# Altium schematic sheet Si4455.SchDoc
size 420 x 297 mm; Address1: Address1; Address2: Address2; Address3: Address3; Address4: Address4; DocumentNumber: 7; SheetNumber: 7; SheetTotal: 7; Scale: 1:1; Обозначение документа: АБВГ.123456.001 Э3; Разраб.: Иванов; Пров.: Петров; Утв.: Сидоров; Наименование организации: ОАО "Ваша фирма"; Перв. применение: АБВГ.123456.000; Наименование изделия 1: Плата; Наименование изделия 2: Схема электрическая; Наименование изделия 3: принципиальная; Нач. отд.: Нач. отд.; Фамилия нач. отд.: Сидоров
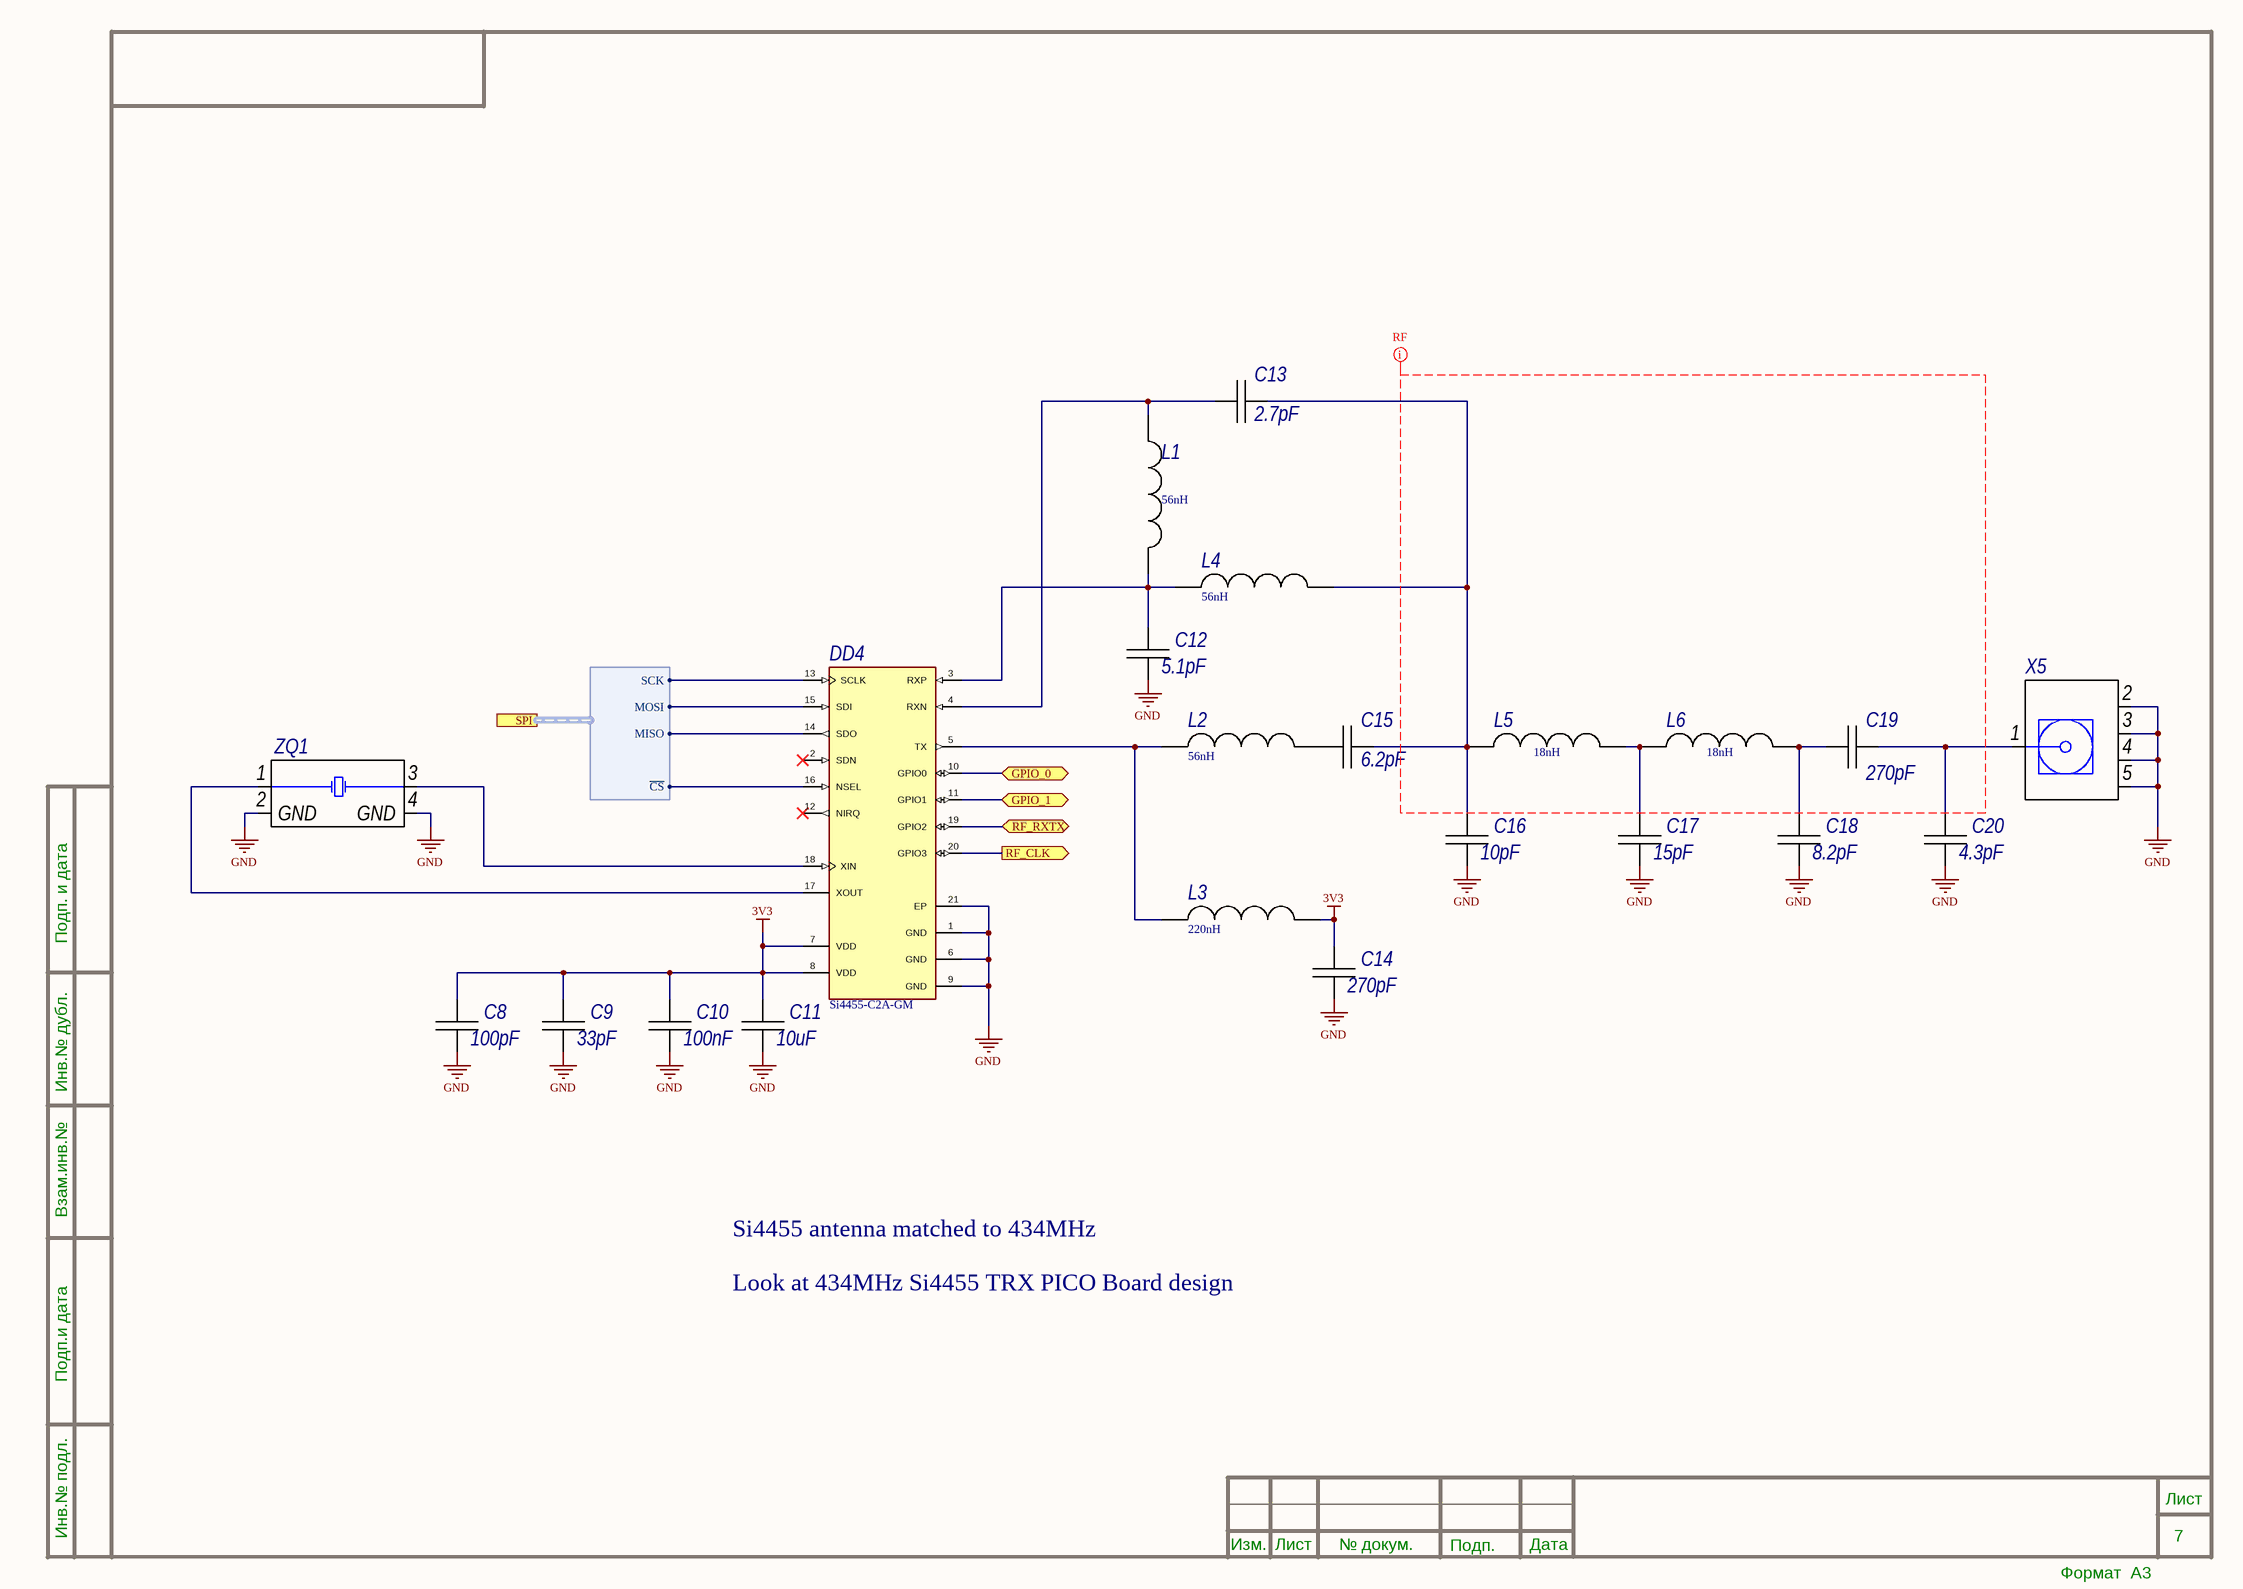
[diagram p0: Si4455.SchDoc]

## Parts
C8  100pF  [CAP0402]
C9  33pF  [CAP0402]
C10  100nF  [CAP0402]
C11  10uF  [CAPC0603N]
C12  5.1pF  [CAP0402]
C13  2.7pF  [CAP0402]
C14  270pF  [CAP0402]
C15  6.2pF  [CAP0402]
C16  10pF  [CAP0402]
C17  15pF  [CAP0402]
C18  8.2pF  [CAP0402]
C19  270pF  [CAP0402]
C20  4.3pF  [CAP0402]
DD4  Si4455-С2A-GM  [SLAB-QFN-20]
L1  56nH  [RESC0402(1005)_M]
L2  56nH  [RESC0402(1005)_M]
L3  220nH  [RESC0402(1005)_M]
L4  56nH  [RESC0402(1005)_M]
L5  18nH  [RESC0402(1005)_M]
L6  18nH  [RESC0402(1005)_M]
X5  (no value)  [60311042114502]
ZQ1  X322525MOB4SI  [TSX-3225_V]  (value not drawn)

## Ports
GPIO_0 (bidir), GPIO_1 (bidir), RF_CLK (out), RF_RXTX (bidir), SPI (harness SPI)

## Harnesses
SPI: SCK, MOSI, MISO, ~{CS}

## Nets
3V3: C8.2 C9.2 C10.2 C11.1 C14.1 DD4.7(VDD) DD4.8(VDD) L3.2
GND: C8.1 C9.1 C10.1 C11.2 C12.2 C14.2 C16.2 C17.2 C18.2 C20.2 DD4.1(GND) DD4.6(GND) DD4.9(GND) DD4.21(EP) X5.2(GND) X5.3(GND) X5.4(GND) X5.5(GND) ZQ1.2(GND) ZQ1.4(GND)
GPIO_0: DD4.10(GPIO0) ; port GPIO_0
GPIO_1: DD4.11(GPIO1) ; port GPIO_1
RF_CLK: DD4.20(GPIO3) ; port RF_CLK
RF_RXTX: DD4.19(GPIO2) ; port RF_RXTX
NetC12_1: C12.1 DD4.3(RXP) L1.2 L4.1
NetC13_1: C13.1 C15.1 C16.1 L4.2 L5.1
NetC13_2: C13.2 DD4.4(RXN) L1.1
NetC15_2: C15.2 L2.2
NetC17_1: C17.1 L5.2 L6.1
NetC18_1: C18.1 C19.1 L6.2
NetC19_2: C19.2 C20.1 X5.1(Signal)
NetDD4_5: DD4.5(TX) L2.1 L3.1
NetDD4_13: DD4.13(SCLK) ; port SPI.SCK
NetDD4_14: DD4.14(SDO) ; port SPI.MISO
NetDD4_15: DD4.15(SDI) ; port SPI.MOSI
NetDD4_16: DD4.16(NSEL) ; port SPI.~{CS}
NetDD4_17: DD4.17(XOUT) ZQ1.1(X1)
NetDD4_18: DD4.18(XIN) ZQ1.3(X2)

Not connected (* = marked no-connect by the designer): DD4 2(SDN)* 12(NIRQ)*

## Layout directives
net class RF_50ohm; rule Width Constraint [Pref Impedance = 50,00ohms    Min Impedance = 50,00ohms    Max Impedance = 50,00ohms]: (no net found under the mark)

## Notes on the sheet
- Si4455 antenna matched to 434MHz
- Look at 434MHz Si4455 TRX PICO Board design
- Подп. и дата
- Инв.№ дубл.
- Взам.инв.№
- Подп.и дата
- Инв.№ подл.
- Изм.
- Лист
- № докум.
- Подп.
- Дата
- Формат  A3

## Library data of the parts
C8 = CAP0402: MntType: SMD; BOMDescription: SMD CHIP CERAMIC CAPACITOR C_0402 100pF; MSL: MSL 1; Package: C_0402; RoHS: Comply; PartType: CHIP CERAMIC CAPACITOR; Pins: 2; CFootprint: =Footprint; Value: 100pF; Part Number: CAP0402; ClassName: Capacitor; ComponentLink1Description: Datasheet
C9 = CAP0402: MntType: SMD; BOMDescription: SMD CHIP CERAMIC CAPACITOR C_0402 33pF; MSL: MSL 1; Package: C_0402; RoHS: Comply; PartType: CHIP CERAMIC CAPACITOR; Pins: 2; CFootprint: =Footprint; Value: 33pF; Part Number: CAP0402; ClassName: Capacitor; ComponentLink1Description: Datasheet
C10 = CAP0402: MntType: SMD; BOMDescription: SMD CHIP CERAMIC CAPACITOR C_0402 100nF; MSL: MSL 1; Package: C_0402; RoHS: Comply; PartType: CHIP CERAMIC CAPACITOR; Pins: 2; CFootprint: =Footprint; Value: 100nF; Part Number: CAP0402; ClassName: Capacitor; ComponentLink1Description: Datasheet
C11 = CAPC: MntType: SMD; MSL: MSL 1; Package: =Footprint; RoHS: Comply; PartType: CHIP CERAMIC CAPACITOR; Pins: 2; BOMDescription: =MntType+' '+PartType+' '+Package+' '+Value+' '+Tolerance+' '+Voltage+' '+TempCoeff+' '+MPN; CFootprint: =Footprint; Value: 10uF; Part Number: CAPC; ClassName: Capacitor; ComponentLink1Description: Datasheet
C12 = CAP0402: MntType: SMD; BOMDescription: SMD CHIP CERAMIC CAPACITOR C_0402 5.1pF; MSL: MSL 1; Package: C_0402; RoHS: Comply; PartType: CHIP CERAMIC CAPACITOR; Pins: 2; CFootprint: =Footprint; Value: 5.1pF; Part Number: CAP0402; ClassName: Capacitor; ComponentLink1Description: Datasheet
C13 = CAP0402: MntType: SMD; BOMDescription: SMD CHIP CERAMIC CAPACITOR C_0402 2.7pF; MSL: MSL 1; Package: C_0402; RoHS: Comply; PartType: CHIP CERAMIC CAPACITOR; Pins: 2; CFootprint: =Footprint; Value: 2.7pF; Part Number: CAP0402; ClassName: Capacitor; ComponentLink1Description: Datasheet
C14 C19 = CAP0402: MntType: SMD; BOMDescription: SMD CHIP CERAMIC CAPACITOR C_0402 270pF; MSL: MSL 1; Package: C_0402; RoHS: Comply; PartType: CHIP CERAMIC CAPACITOR; Pins: 2; CFootprint: =Footprint; Value: 270pF; Part Number: CAP0402; ClassName: Capacitor; ComponentLink1Description: Datasheet
C15 = CAP0402: MntType: SMD; BOMDescription: SMD CHIP CERAMIC CAPACITOR C_0402 6.2pF; MSL: MSL 1; Package: C_0402; RoHS: Comply; PartType: CHIP CERAMIC CAPACITOR; Pins: 2; CFootprint: =Footprint; Value: 6.2pF; Part Number: CAP0402; ClassName: Capacitor; ComponentLink1Description: Datasheet
C16 = CAP0402: MntType: SMD; BOMDescription: SMD CHIP CERAMIC CAPACITOR C_0402 10pF; MSL: MSL 1; Package: C_0402; RoHS: Comply; PartType: CHIP CERAMIC CAPACITOR; Pins: 2; CFootprint: =Footprint; Value: 10pF; Part Number: CAP0402; ClassName: Capacitor; ComponentLink1Description: Datasheet
C17 = CAP0402: MntType: SMD; BOMDescription: SMD CHIP CERAMIC CAPACITOR C_0402 15pF; MSL: MSL 1; Package: C_0402; RoHS: Comply; PartType: CHIP CERAMIC CAPACITOR; Pins: 2; CFootprint: =Footprint; Value: 15pF; Part Number: CAP0402; ClassName: Capacitor; ComponentLink1Description: Datasheet
C18 = CAP0402: MntType: SMD; BOMDescription: SMD CHIP CERAMIC CAPACITOR C_0402 8.2pF; MSL: MSL 1; Package: C_0402; RoHS: Comply; PartType: CHIP CERAMIC CAPACITOR; Pins: 2; CFootprint: =Footprint; Value: 8.2pF; Part Number: CAP0402; ClassName: Capacitor; ComponentLink1Description: Datasheet
C20 = CAP0402: MntType: SMD; BOMDescription: SMD CHIP CERAMIC CAPACITOR C_0402 4.3pF; MSL: MSL 1; Package: C_0402; RoHS: Comply; PartType: CHIP CERAMIC CAPACITOR; Pins: 2; CFootprint: =Footprint; Value: 4.3pF; Part Number: CAP0402; ClassName: Capacitor; ComponentLink1Description: Datasheet
DD4 = Si4455-С2A-GM: Manufacturer: SiLabs; MntType: SMD; ComponentLink1URL: https://www.silabs.com/documents/public/data-sheets/Si4455.pdf; ComponentLink1Description: Datasheet; Part Number: Si4455-С2A-GM; MPN: Si4455-С2A-GM; MSL: MSL 1; Package: QFN20; RoHS: Comply; PartType: RF; Pins: 21; BOMDescription: Si4455-С2A-GM; CFootprint: =Footprint; ClassName: RF
L1-L6 = Inductor_SMD: Manufacturer: TDK; MPN: MLF2012; MntType: SMD; MSL: MSL 1; Package: RESC0402(1005)_M; RoHS: Comply; PartType: INDUCTOR; Pins: 2; BOMDescription: =MntType+' '+PartType+' '+Package+' '+Value+' '+Tolerance+' '+Voltage+' '+TempCoeff+' '+MPN; CFootprint: RESC0402(1005)_M; Part Number: Inductor_SMD; ClassName: Inductor; ComponentLink1Description: Datasheet
  L1 L2 L4: Value: 56nH
  L3: Value: 220nH
  L5 L6: Value: 18nH
X5 = SMA_WR_60311042114502: Manufacturer: WE; MntType: SMD; Part Number: SMA_WR_60311042114502; MPN: 60311042114502; MSL: MSL 1; RoHS: Comply; PartType: SMA; Pins: 5; BOMDescription: =MntType+' '+PartType+' '+Package+' '+Value+' '+Tolerance+' '+Voltage+' '+TempCoeff+' '+MPN; CFootprint: 60311042114502; ClassName: SMA; ComponentLink1Description: Datasheet; ComponentLink1URL: https://katalog.we-online.de/em/datasheet/60311042114502.pdf
ZQ1 = X322525MOB4SI: Manufacturer: Yangxing Tech; MntType: SMD; BOMDescription: SMD XTAL X322525MOB4SI; Part Number: X322525MOB4SI; Value: X322525MOB4SI; MPN: X322525MOB4SI; MSL: MSL 1; RoHS: Comply; PartType: XTAL; Pins: 4; CFootprint: TSX-3225_V; ClassName: XTAL; ComponentLink1Description: Datasheet; ComponentLink1URL: https://datasheet.lcsc.com/szlcsc/Yangxing-Tech-X322525MOB4SI_C9006.pdf